# Altium schematic sheet 5_FPGA_Banks_3_7.SchDoc
size A4; Organization: SpaceLab UFSC; Address1: UFSC - SpaceLab; Address2: University Campus - Trindade; Address3: Dep. of Electrical Engineering - CTC; Address4: Florianópolis, Santa Catarina, Brazil; Address5: CEP: 88040 - 900
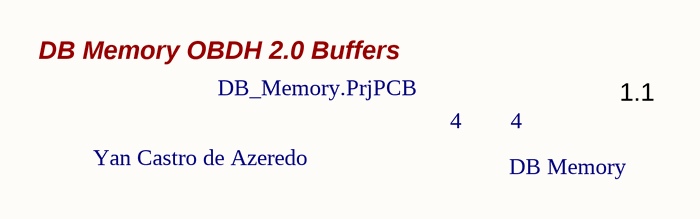
[diagram p0: 5_FPGA_Banks_3_7.SchDoc]

## Notes on the sheet
- DB Memory OBDH 2.0 Buffers
- DB_Memory.PrjPCB
- 4
- 1.1
- Yan Castro de Azeredo
- DB Memory
- Title:
- Size:
- Date:
- A4
- Project:
- Time:
- Sheet
- of
- Revision:
- UFSC - SpaceLab
- University Campus - Trindade
- Dep. of Electrical Engineering - CTC
- Florianópolis, Santa Catarina, Brazil
- CEP: 88040 - 900
- Drawn By:
- Model: